# EAGLE design LED_Matrix (EAGLE 7.6.0)
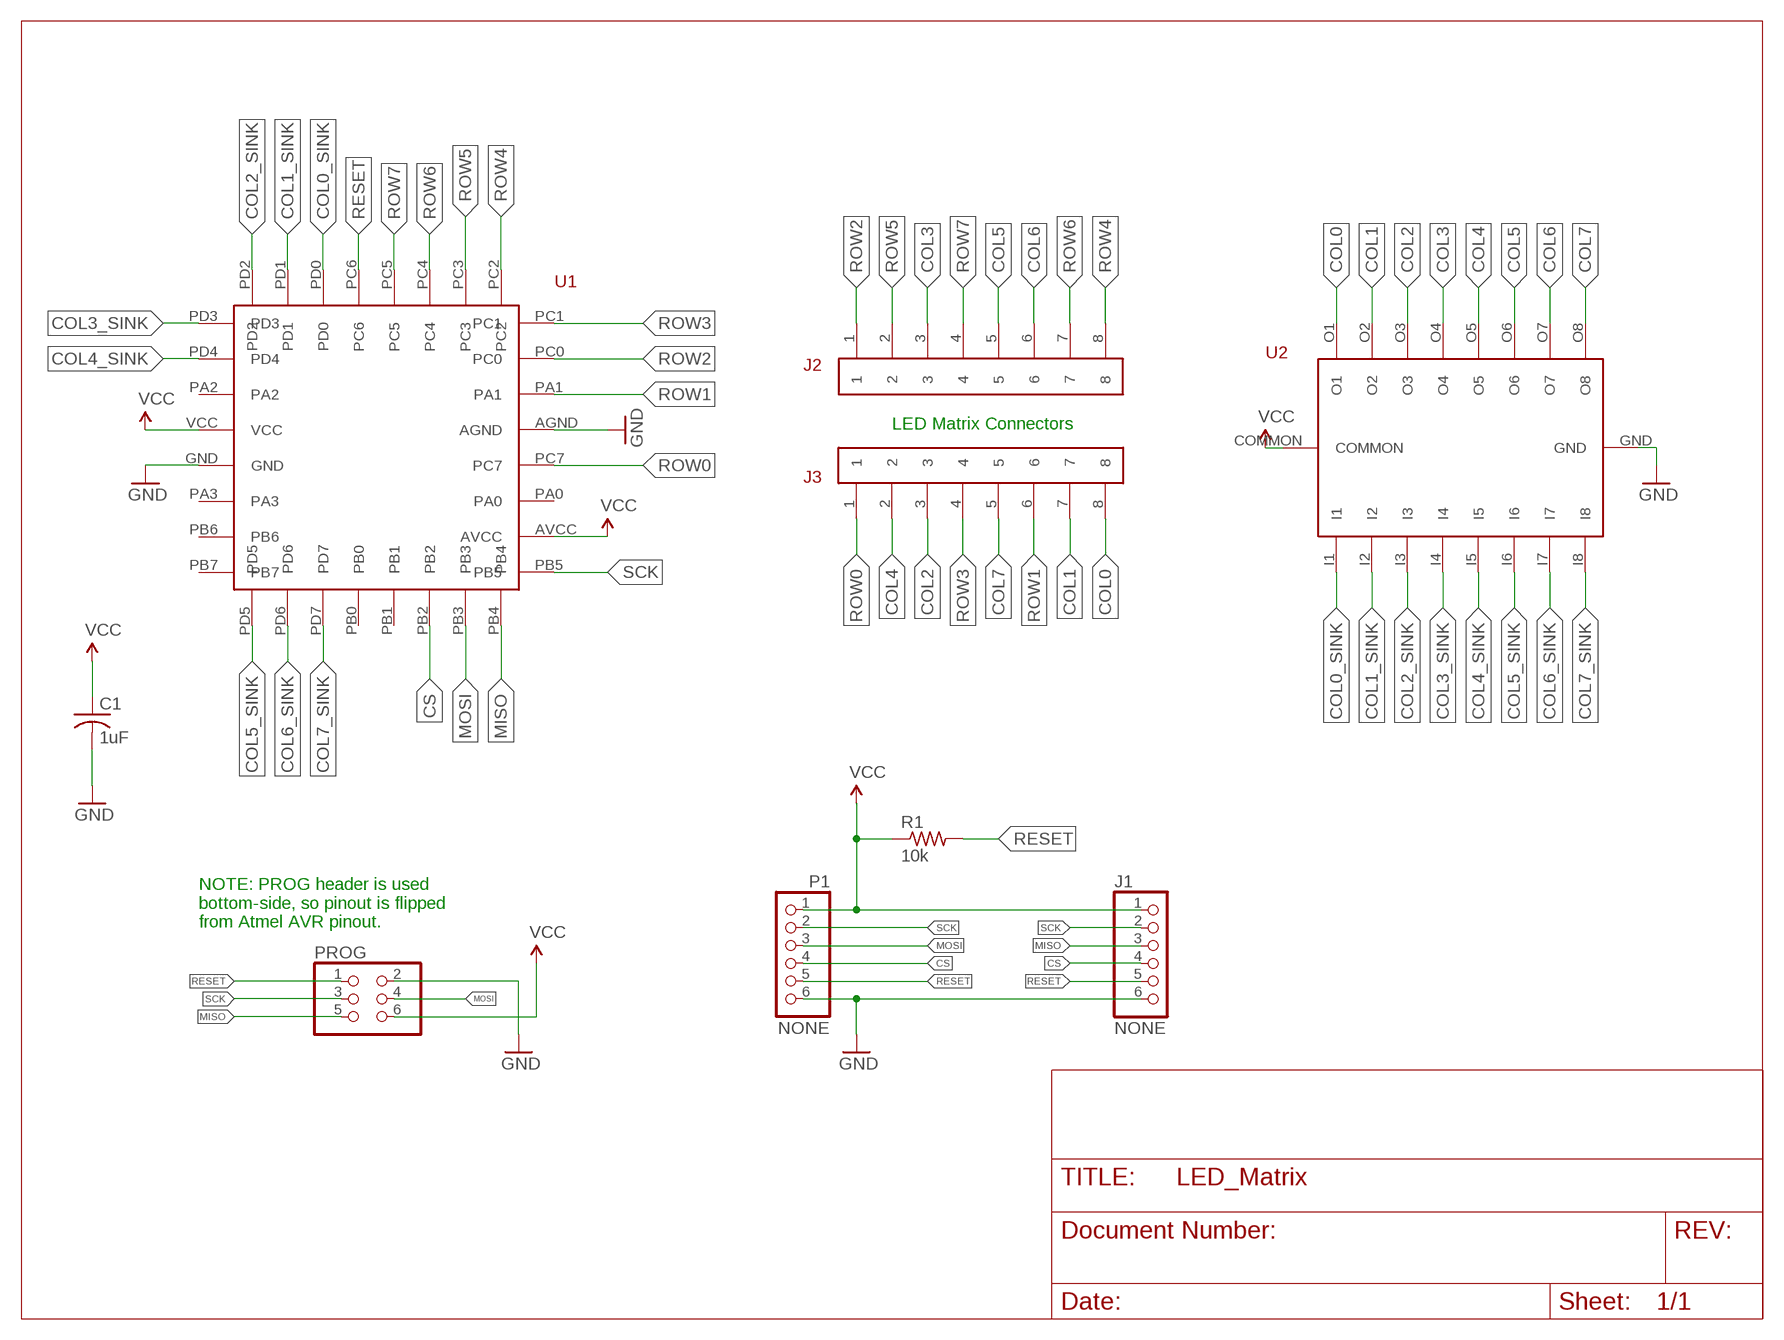
[diagram p0: schematic, sheet 1]

## Parts
C1  1uF  C-USC0603  [C0603]
J1  NONE  PINHD-1X6  [1X06]
J2  HEADER-1X8  [HEADER-1X8]
J3  HEADER-1X8  [HEADER-1X8]
P1  NONE  PINHD-1X6  [1X06]
PROG  NONE  PINHD-2X3  [2X03]
R1  10k  R-US_R0603  [R0603]
U1  ATTINY48  [ATTINY48]
U2  ULN2803AFWG  [ULN2803AFWG]

## Nets
COL0: J3.8 U2.O1
COL0_SINK: U1.PD0 U2.I1
COL1: J3.7 U2.O2
COL1_SINK: U1.PD1 U2.I2
COL2: J3.3 U2.O3
COL2_SINK: U1.PD2 U2.I3
COL3: J2.3 U2.O4
COL3_SINK: U1.PD3 U2.I4
COL4: J3.2 U2.O5
COL4_SINK: U1.PD4 U2.I5
COL5: J2.5 U2.O6
COL5_SINK: U1.PD5 U2.I6
COL6: J2.6 U2.O7
COL6_SINK: U1.PD6 U2.I7
COL7: J3.5 U2.O8
COL7_SINK: U1.PD7 U2.I8
CS: J1.4 P1.4 U1.PB2
GND: C1.2 J1.6 P1.6 PROG.2 U1.AGND U1.GND U2.GND
MISO: J1.3 PROG.5 U1.PB4
MOSI: P1.3 PROG.4 U1.PB3
RESET: J1.5 P1.5 PROG.1 R1.2 U1.PC6
ROW0: J3.1 U1.PC7
ROW1: J3.6 U1.PA1
ROW2: J2.1 U1.PC0
ROW3: J3.4 U1.PC1
ROW4: J2.8 U1.PC2
ROW5: J2.2 U1.PC3
ROW6: J2.7 U1.PC4
ROW7: J2.4 U1.PC5
SCK: J1.2 P1.2 PROG.3 U1.PB5
VCC: C1.1 J1.1 P1.1 PROG.6 R1.1 U1.AVCC U1.VCC U2.COMMON
Unconnected: U1.PA0 U1.PA2 U1.PA3 U1.PB0 U1.PB1 U1.PB6 U1.PB7

## Notes on the sheet
- LED Matrix Connectors
- NOTE: PROG header is used 
  bottom-side, so pinout is flipped 
  from Atmel AVR pinout.

## Library data of the parts
C1 = resistor:C-US: CAPACITOR, American symbol
J1 P1 = LED_Matrix:PINHD-1X6: PIN HEADER
J2 J3 = LED_Matrix:HEADER-1X8
PROG = LED_Matrix:PINHD-2X3: PIN HEADER
R1 = resistor:R-US_: RESISTOR, American symbol
U1 = LED_Matrix:ATTINY48
U2 = LED_Matrix:ULN2803AFWG

## Net classes
1 power: width 0.305 mm

## Board
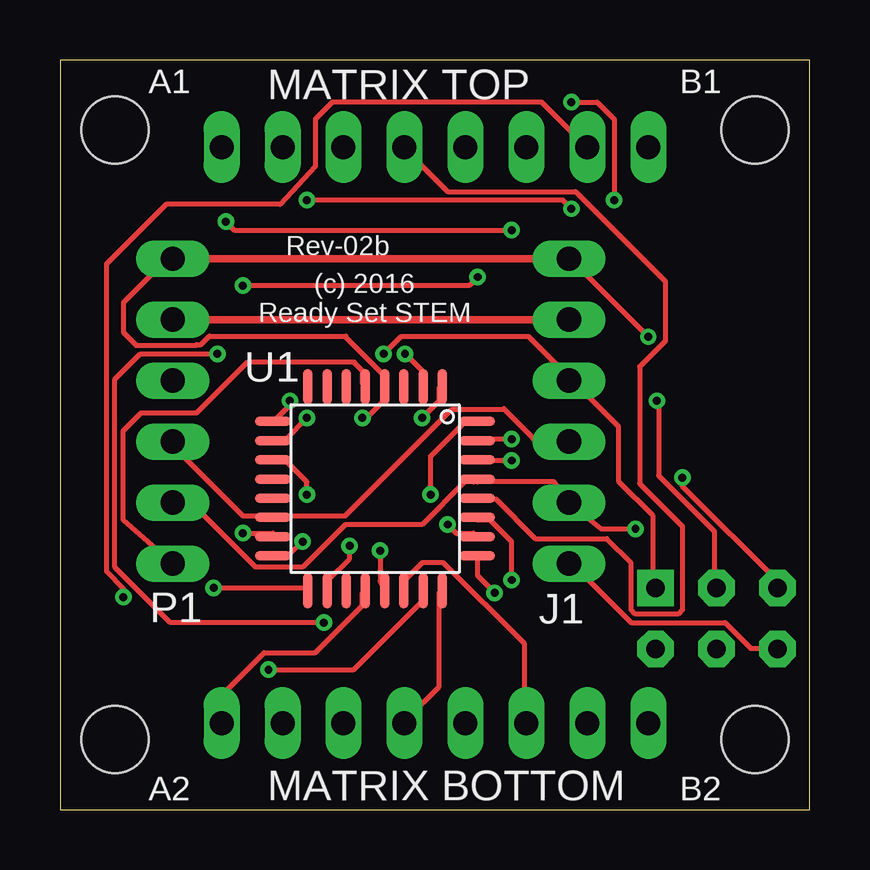
[diagram p1: board, top side]
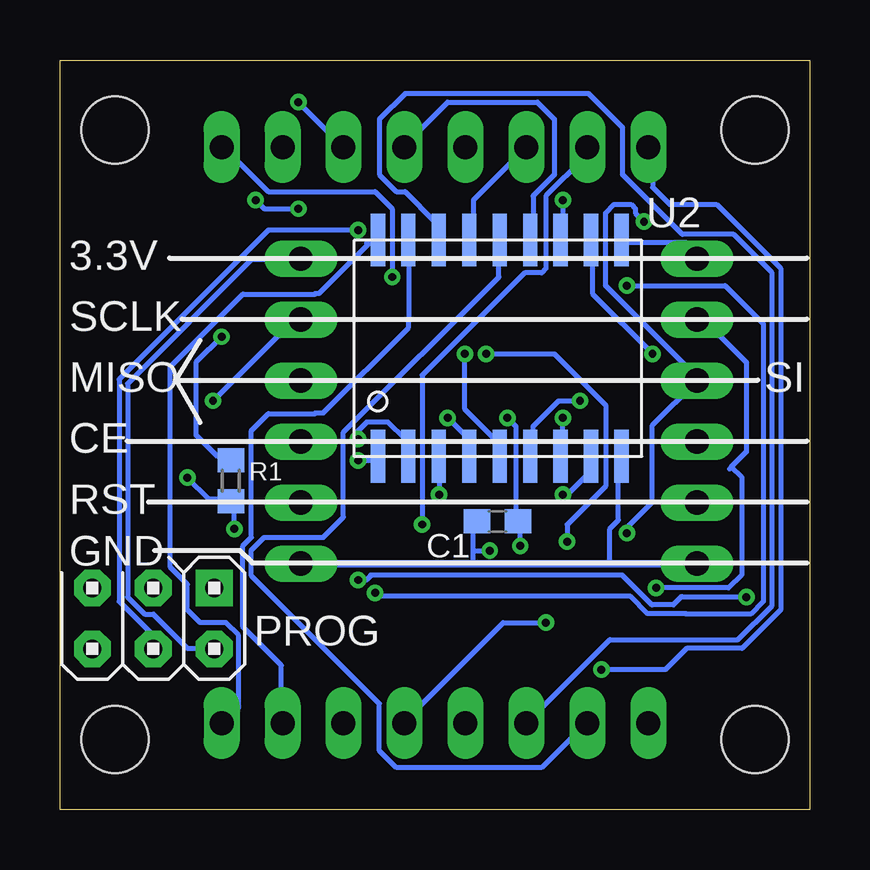
[diagram p2: board, bottom side, seen from below]

Size 31.24 x 31.24 mm. Coordinates in mm from the lower left corner, seen from the top.
Outline: 0,0 31.24,0 31.24,31.24 0,31.24 0,0
Copper layers (1*16): Top 0.0356mm / dielectric 1.5011mm / Bottom 0.0356mm
Design rules "LaenPCBOrder *": minimum track width 8mil, minimum drill 13mil, track to track 6mil, track to pad 6mil, pad to pad 6mil, via to via 6mil, smd to smd 6mil, copper to edge 15mil, drill to drill 6mil, minimum pad ring 7mil, minimum via ring 7mil, stop-mask expansion 3mil, vias tented up to drill 0mil, thermal gap 10mil
Holes 2.79 mm at 2.29,2.92 2.29,28.32 28.96,28.32 28.96,2.92
tRestrict: area 0,0 to 5.8,5.8; area 0,25.4 to 5.8,31.2; area 25.4,25.4 to 31.2,31.2; area 25.4,0 to 31.2,5.8
bRestrict: area 0,0 to 5.8,5.8; area 0,25.4 to 5.8,31.2; area 25.4,25.4 to 31.2,31.2; area 25.4,0 to 31.2,5.8
vRestrict: area 27.4,9.8 to 31.2,23.9; area 0,17 to 2.2,19; area 0,0 to 5.8,5.8; area 0,25.4 to 5.8,31.2; area 25.4,25.4 to 31.2,31.2; area 25.4,0 to 31.2,5.8

### Footprints (pad centres in the part's own frame; a part is rotated, then mirrored left to right if it is on the bottom)
C0603 = smd 1.1 x 1: 1 -0.85,0; 2 0.85,0
1X06 = drill 1.016 long: 1 -6.35,0; 2 -3.81,0; 3 -1.27,0; 4 1.27,0; 5 3.81,0; 6 6.35,0
HEADER-1X8 = drill 1 long: 1 -8.89,0; 2 -6.35,0; 3 -3.81,0; 4 -1.27,0; 5 1.27,0; 6 3.81,0; 7 6.35,0; 8 8.89,0
2X03 = drill 0.762 pad 1.524 octagon: 1 -2.54,-1.27; 2 -2.54,1.27; 3 0,-1.27; 4 0,1.27; 6 2.54,1.27 | drill 0.762 pad 1.524 square: 5 2.54,-1.27
R0603 = smd 1 x 1.1: 1 -0.85,0; 2 0.85,0
ATTINY48 = smd 1.5 x 0.406: AGND 4.25,0.4; AVCC 4.25,-2; GND -4.25,-0.4; PA0 4.25,-1.2; PA1 4.25,1.2; PA2 -4.25,1.2; PA3 -4.25,-1.2; PB5 4.25,-2.8; PB6 -4.25,-2; PB7 -4.25,-2.8; PC0 4.25,2; PC1 4.25,2.8; PC7 4.25,-0.4; PD3 -4.25,2.8; PD4 -4.25,2; VCC -4.25,0.4 | smd 0.406 x 1.5: PB0 -0.4,-4.25; PB1 0.4,-4.25; PB2 1.2,-4.25; PB3 2,-4.25; PB4 2.8,-4.25; PC2 2.8,4.25; PC3 2,4.25; PC4 1.2,4.25; PC5 0.4,4.25; PC6 -0.4,4.25; PD0 -1.2,4.25; PD1 -2,4.25; PD2 -2.8,4.25; PD5 -2.8,-4.25; PD6 -2,-4.25; PD7 -1.2,-4.25
ULN2803AFWG = smd 0.6 x 2.2: COMMON 10.16,9.01; GND 10.16,0; I1 0,0; I2 1.27,0; I3 2.54,0; I4 3.81,0; I5 5.08,0; I6 6.35,0; I7 7.62,0; I8 8.89,0; O1 0,9.01; O2 1.27,9.01; O3 2.54,9.01; O4 3.81,9.01; O5 5.08,9.01; O6 6.35,9.01; O7 7.62,9.01; O8 8.89,9.01

### Placement (x,y rotation side)
C1  13.01,12.02 180 bottom
J1  21.21,16.61 270 top
J2  15.62,27.61 0 top
J3  15.62,3.61 0 top
P1  4.7,16.61 270 top
PROG  27.36,7.98 180 top
R1  24.12,13.71 270 bottom
U1  13.13,13.38 270 top
U2  18,14.73 0 bottom

### Tracks (layer width: path | path; a pad name or v marks a point on that pad's centre or on a via)
COL0
  Bottom 0.203: 18.47,23.62 18.31,23.62 | 18.31,23.62 18.11,23.62 U2.O1 | 20.62,21.49 23.62,21.49 26.64,18.47 26.64,10.11 25.93,9.4 25.93,8.33 25.4,7.8 24.33,7.8 23.8,7.26 23.8,4.24 24.24,3.8 | 20.62,21.49 20.6,21.49 | 24.33,3.71 24.24,3.8 | J3.8 24.41,3.61 24.23,3.79 24.24,3.8 | 18.31,23.62 18.31,23.65 20.45,21.51 20.62,21.51 20.62,21.49
COL0_SINK  (via drill 0.33)
  Top 0.203: v18.82,14.55 17.4,14.55 U1.PD0
  Bottom 0.203: v18.82,14.55 18.11,14.55 U2.I1
COL1
  Bottom 0.203: 16.69,20.42 16.69,20.45 | 16.69,20.45 16.69,23.62 U2.O2 | 20.62,16.51 22.55,16.51 23.27,15.8 23.27,11.35 23.62,11 23.62,7.62 22.02,6.02 22.02,3.79 | 20.62,16.51 20.6,16.51 | 22.02,3.71 22.02,3.79 | J3.7 22.1,3.61 22.1,3.79 22.02,3.79 | 16.69,20.45 16.71,20.45 16.71,20.09 20.27,16.54 20.62,16.54 20.62,16.51
COL1_SINK  (via drill 0.33)
  Top 0.203: v18.82,15.44 17.4,15.44 U1.PD1
  Bottom 0.203: v18.82,15.44 18.82,15.8 18.47,16.15 17.58,16.15 16.87,15.44 16.87,14.73 U2.I2
COL2
  Bottom 0.203: 11.71,3.71 11.62,3.8 | 11.62,3.8 8.33,7.09 3,7.09 1.57,8.51 1.57,22.38 3.17,23.98 5.31,23.98 7.8,26.47 7.8,28.42 9.22,29.84 16.87,29.84 17.93,28.78 17.93,26.47 17.22,25.76 16.87,25.76 15.62,24.51 15.62,23.8 U2.O3 | J3.3 11.79,3.61 11.61,3.79 11.62,3.8
COL2_SINK  (via drill 0.33)
  Top 0.203: v15.44,13.13 15.44,14.73 16.87,16.15 17.22,16.15 U1.PD2
  Bottom 0.203: v15.44,13.13 15.44,14.55 U2.I3
COL3
  Bottom 0.203: 11.89,27.53 11.98,27.45 | 11.98,27.45 14.02,25.4 14.02,23.8 U2.O4 | J2.3 11.96,27.61 11.96,27.43 11.98,27.45
COL3_SINK  (via drill 0.33)
  Top 0.203: v15.09,16.33 15.8,17.04 15.8,17.58 U1.PD3
  Bottom 0.203: v15.09,16.33 14.2,15.44 U2.I4
COL4
  Bottom 0.203: 9.4,3.53 9.49,3.44 | 9.49,3.44 11.18,1.75 17.22,1.75 17.93,2.46 17.93,4.42 23.27,9.75 23.27,10.82 22.73,11.35 20.27,11.35 19.43,12.19 19.43,15.72 12.95,22.2 12.95,23.62 U2.O5 | J3.2 9.3,3.61 9.47,3.43 9.49,3.44
COL4_SINK  (via drill 0.33)
  Top 0.203: v14.38,19 15.09,18.29 15.09,17.75 U1.PD4
  Bottom 0.203: v14.38,19 14.38,16.69 12.95,15.27 12.95,14.73 U2.I5
COL5
  Bottom 0.203: 16.87,27.71 16.78,27.8 | 16.78,27.8 15.09,29.49 11.35,29.49 10.64,28.78 10.64,26.47 11.53,25.58 11.53,23.8 U2.O6 | J2.5 16.76,27.61 16.76,27.79 16.78,27.8
COL5_SINK  (via drill 0.33)
  Top 0.203: v9.58,17.04 9.58,16.87 9.04,16.33 U1.PD5
  Bottom 0.203: v9.58,17.04 10.46,17.04 11.53,15.98 11.53,14.73 U2.I6
COL6  (via drill 0.33)
  Top 0.203: v10.29,25.4 20.95,25.4 v21.31,25.04 | v23.09,25.4 23.09,28.78 22.38,29.49 v21.31,29.49
  Bottom 0.203: v10.29,25.4 10.29,23.8 U2.O7 | v21.31,25.04 22.73,25.04 v23.09,25.4 | J2.6 v21.31,29.49
COL6_SINK  (via drill 0.33)
  Top 0.203: v10.29,16.33 9.4,15.44 9.04,15.44 U1.PD6
  Bottom 0.203: v10.29,16.33 10.29,14.73 U2.I7
COL7  (via drill 0.33)
  Top 0.203: v6.55,19 3.35,19 2.29,17.93 2.29,10.11 4.6,7.8 v11,7.8
  Bottom 0.203: v6.55,19 9.04,21.49 9.04,23.62 U2.O8 | v11,7.8 12.78,7.8 16.78,3.8 | 16.87,3.71 16.78,3.8 | J3.5 16.76,3.61 16.76,3.79 16.78,3.8
COL7_SINK  (via drill 0.33)
  Top 0.203: v10.29,13.13 10.29,13.66 9.4,14.55 9.04,14.55 U1.PD7
  Bottom 0.203: v10.29,13.13 10.11,13.13 9.22,14.02 9.22,14.55 U2.I8
CS
  Top 0.203: P1.4 4.6,15.27 7.62,12.24 8.87,12.24 U1.PB2 9.04,12.24 11.89,12.24 16.33,16.69 18.47,16.69 18.49,16.71 19.74,15.47 J1.4 21.31,15.44 19.71,15.44
GND  (via drill 0.33)
  Top 0.203: P1.6 2.64,12.06 2.64,15.8 3.38,16.54 5.69,16.54 7.82,18.67 12.27,18.67 12.24,18.64 12.6,18.29 12.6,17.75 U1.GND | PROG.2 29.84,6.73 28.78,6.73 27.71,7.8 23.8,7.8 21.49,10.11 J1.6 | v13.34,10.79 13.34,9.53 U1.AGND
  Bottom 0.203: 14.02,10.26 14.02,10.79 | 14.02,10.79 14.02,11.89 C1.2 | 8.33,10.26 8.33,11.71 7.98,12.06 7.98,14.55 U2.GND | 14.02,10.79 v13.34,10.79
  Bottom 0.305: P1.6 8.33,10.26 14.02,10.26 J1.6
MISO  (via drill 0.33)
  Top 0.203: v10.11,11.18 9.58,10.64 9.04,10.64 U1.PB4 | v13.49,19 14.2,19.71 19.53,19.71 21.31,17.93 J1.3 21.49,17.75 23.27,15.98 23.27,13.69 24.69,12.27 24.69,9.4 PROG.5
  Bottom 0.203: v10.11,11.18 10.11,11.89 8.51,13.49 8.51,16.87 10.64,19 v13.49,19
MOSI  (via drill 0.33)
  Top 0.203: v7.62,11.53 8.87,11.53 U1.PB3 | v18.82,24.16 7.26,24.16 v6.91,24.51
  Bottom 0.203: 4.6,17.75 P1.3 | PROG.4 27.36,7.26 28.78,8.69 28.78,17.93 22.55,24.16 v18.82,24.16 | v6.91,24.51 7.26,24.87 7.26,25.04 7.44,25.22 8.15,25.22 8.51,24.87 8.51,21.84 4.6,17.93 P1.3 | P1.3 6.58,16 6.58,12.8 7.64,11.73 v7.62,11.53
RESET  (via drill 0.33)
  Top 0.203: P1.5 4.6,12.78 5.49,12.78 8.15,10.11 10.11,10.11 11.89,11.89 15.09,11.89 16.87,13.66 17.22,13.66 U1.PC6 17.4,13.66 20.6,13.66 J1.5 22.55,11.71 v23.98,11.71 | v25.93,13.84 25.93,13.49 30.02,9.4 PROG.1
  Bottom 0.203: v23.98,11.71 23.98,12.78 R1.2 24.16,12.95 25.04,12.95 v25.93,13.84
ROW0
  Top 0.203: 6.73,3.71 6.73,3.79 | 6.73,3.79 6.73,4.78 8.51,6.55 10.64,6.55 12.6,8.51 12.6,9.04 U1.PC7 | J3.1 6.81,3.61 6.81,3.79 6.73,3.79
ROW1
  Top 0.203: 19.36,3.71 19.36,3.79 | 19.36,3.79 19.36,6.91 15.98,10.29 15.09,10.29 14.38,9.58 14.38,9.22 U1.PA1 | J3.6 19.43,3.79 19.36,3.79
ROW2  (via drill 0.33)
  Top 0.203: v8.69,5.84 12.24,5.84 15.09,8.69 15.09,9.04 U1.PC0
  Bottom 0.203: v8.69,5.84 6.02,5.84 5.13,6.73 2.82,6.73 1.22,8.33 1.22,22.55 3.89,25.22 5.84,25.22 6.55,25.93 6.55,27.43 | 6.55,27.53 6.55,27.43 | J2.1 6.63,27.61 6.63,27.43 6.55,27.43
ROW3
  Top 0.203: 14.38,3.71 14.45,3.79 | 14.45,3.79 15.8,5.13 15.8,9.04 U1.PC1 | 14.45,3.79 14.45,3.61 J3.4
ROW4  (via drill 0.33)
  Top 0.203: v18.11,9.04 17.4,9.75 17.4,10.46 U1.PC2 | v7.62,21.84 17.04,21.84 v17.4,22.2
  Bottom 0.203: v7.62,21.84 3.53,21.84 1.93,20.24 1.93,8.69 2.46,8.15 5.13,8.15 5.16,8.18 6.76,8.18 7.47,8.89 17.96,8.89 v18.11,9.04 | v17.4,22.2 17.4,25.04 18.11,25.76 22.55,25.76 24.41,27.61 J2.8
ROW5  (via drill 0.33)
  Top 0.203: v16.15,11.89 16.51,11.53 17.22,11.53 U1.PC3
  Bottom 0.203: v16.15,11.89 16.15,18.11 11.89,22.38 11.18,22.38 11,22.55 11,25.58 9.4,27.18 9.4,27.43 | 9.4,27.53 9.4,27.43 | J2.2 9.3,27.61 9.47,27.43 9.4,27.43
ROW6  (via drill 0.33)
  Top 0.203: v18.82,9.58 18.82,11.18 17.93,12.06 17.4,12.06 U1.PC4 | v2.64,8.87 2.64,9.22 1.93,9.93 1.93,22.73 4.42,25.22 9.17,25.22 10.64,26.82 10.64,28.78 11.35,29.49 20.07,29.49 21.75,27.8 | 21.84,27.71 21.75,27.8 | J2.7 21.92,27.61 21.74,27.79 21.75,27.8
  Bottom 0.203: v18.82,9.58 18.47,9.58 18.29,9.75 18.31,9.78 7.82,9.78 6.58,8.53 5.69,8.53 5.33,8.89 5.31,8.87 v2.64,8.87
ROW7
  Top 0.203: 14.38,27.53 14.46,27.45 | 14.46,27.45 16.15,25.76 21.49,25.76 25.22,22.02 25.22,19.53 24.16,18.47 24.16,13.59 25.93,11.81 25.93,8.33 25.76,8.15 23.98,8.15 23.8,8.33 23.8,10.29 22.78,11.3 19.81,11.3 18.16,12.95 17.4,12.95 U1.PC5 | J2.4 14.45,27.61 14.45,27.43 14.46,27.45
SCK  (via drill 0.33)
  Top 0.203: PROG.3 27.25,9.3 27.25,11.61 24.94,13.92 24.94,16.94 v24.87,17.04 | v6.4,9.25 10.31,9.25 U1.PB5
  Top 0.305: P1.2 J1.2
  Bottom 0.203: 3.26,14.29 2.64,14.91 2.64,18.64 4.42,20.42 P1.2 | 3.26,14.29 3.35,14.2 | v24.87,17.04 21.49,20.42 J1.2 | v6.4,9.25 3.38,9.25 2.85,9.78 2.85,13.87 3.26,14.29
VCC  (via drill 0.33)
  Top 0.203: v12.06,11 12.06,10.46 11.18,9.58 11.18,9.22 U1.AVCC | v24.51,19.71 21.31,22.91 J1.1 | P1.1 4.42,22.91 2.64,21.13 2.64,19.89 3.17,19.36 5.66,19.36 5.69,19.38 5.87,19.38 6.22,19.74 11.91,19.74 11.89,19.71 13.49,18.11 13.49,17.75 U1.VCC 13.49,17.58 13.49,17.04 12.78,16.33 v12.6,16.33
  Top 0.305: P1.1 J1.1
  Bottom 0.203: v12.06,11 12.06,11.89 C1.1 12.24,12.06 12.24,15.98 v12.6,16.33 | v24.51,19.71 25.58,18.64 25.58,15.62 24.69,14.73 24.16,14.73 R1.1 | U2.COMMON 7.8,23.62 5.13,23.62 4.6,23.09 P1.1 | PROG.6 24.87,6.73 25.93,6.73 27.36,8.15 27.71,8.15 28.42,8.87 28.42,17.75 23.27,22.91 21.49,22.91 J1.1

### Text on the board
tPlace: A1 | MATRIX TOP | B1 | Rev-02b | (c) 2016 / Ready Set STEM | A2 | MATRIX BOTTOM | B2
bPlace: 3.3V | SCLK | SI | MISO | CE | RST | GND